# Altium schematic sheet 1.1.6_Interface_board_Pressure&IMU.SchDoc
size A4; DocumentNumber: 8; SheetNumber: 8; SheetTotal: 14
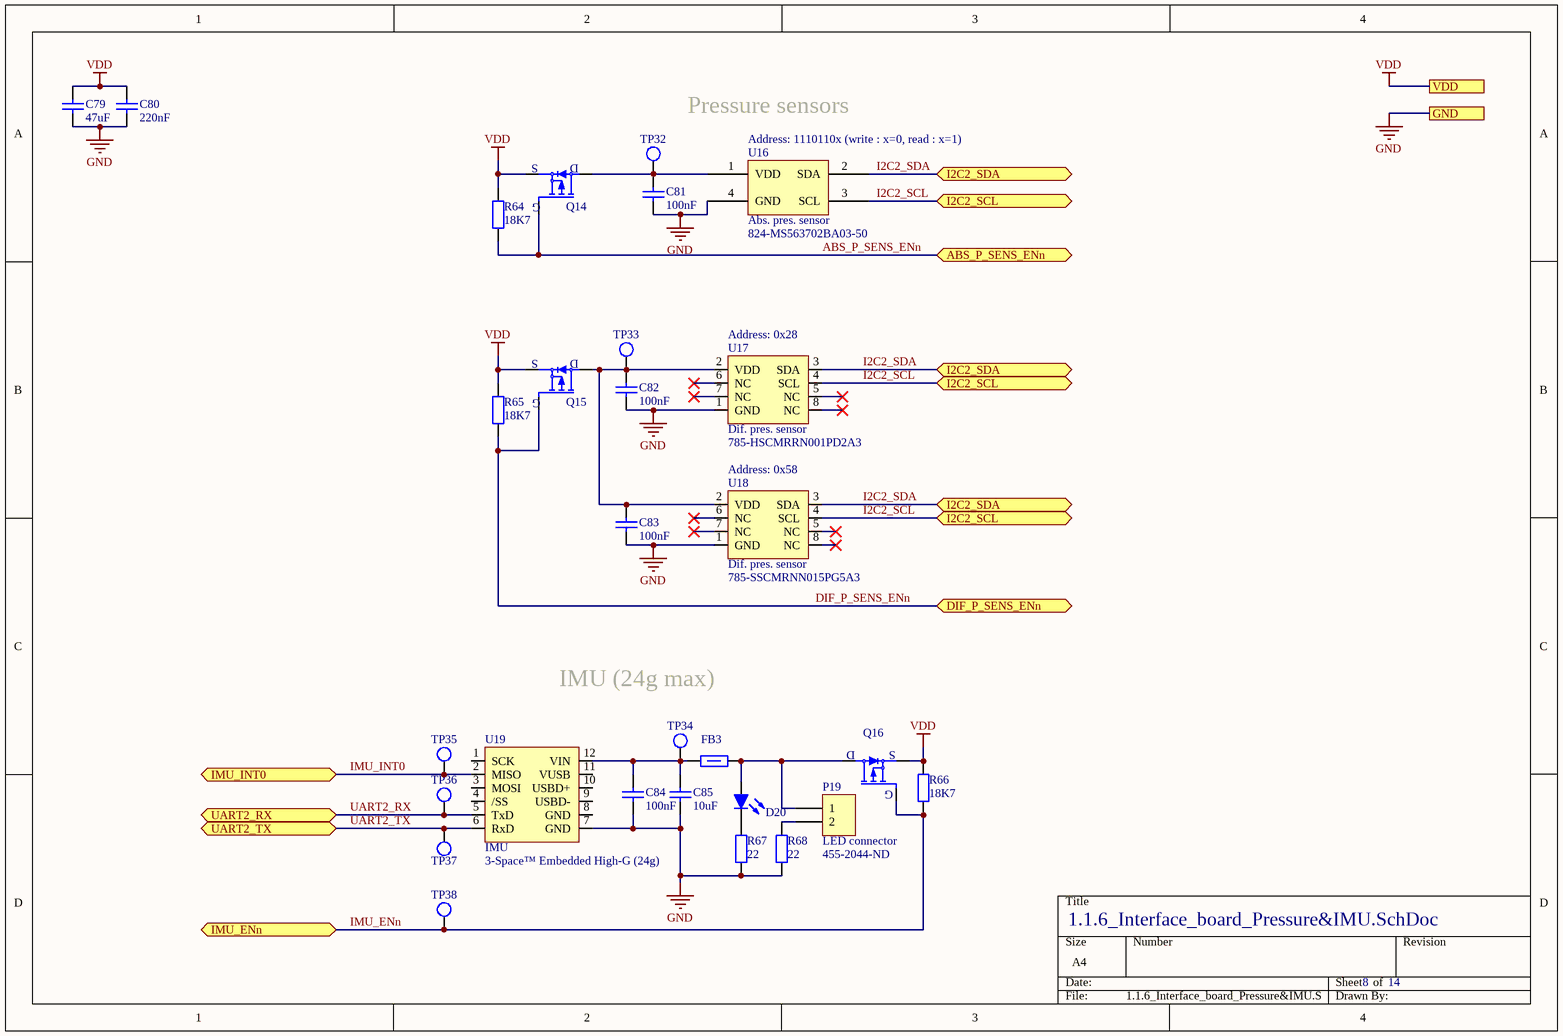
[diagram p0: 1.1.6_Interface_board_Pressure&IMU.SchDoc]

## Parts
C79  47uF  [CAP1206W]
C80  220nF  [CAP0603R]
C81  100nF  [CAP0603R]
C82  100nF  [CAP0603R]
C83  100nF  [CAP0603R]
C84  100nF  [CAP0603R]
C85  10uF  [CAP0805W]
D20  LED  [WL-SMCW]  (value not drawn)
FB3  81-BLM18KG601SZ1D  [0603]  (value not drawn)
P19  LED connector  Supplier Part Number 1: 455-2044-ND  [CON_JST_XA_ S02B-XASS-1]
Q14  MOSFET_P  [SOT23]  (value not drawn)
Q15  MOSFET_P  [SOT23]  (value not drawn)
Q16  MOSFET_P  [SOT23]  (value not drawn)
R64  18K7  [0603]
R65  18K7  [0603]
R66  18K7  [0603]
R67  22  [0603]
R68  22  [0603]
TP32  Test point  [TP]  (value not drawn)
TP33  Test point  [TP]  (value not drawn)
TP34  Test point  [TP]  (value not drawn)
TP35  Test point  [TP]  (value not drawn)
TP36  Test point  [TP]  (value not drawn)
TP37  Test point  [TP]  (value not drawn)
TP38  Test point  [TP]  (value not drawn)
U16  Abs. pres. sensor  Supplier Part Number 1: 824-MS563702BA03-50  [SMD_3.0X3.0MM_4P]
U17  Dif. pres. sensor  Supplier Part Number 1: 785-HSCMRRN001PD2A3  [HSCMRRN060PDSA3]
U18  Dif. pres. sensor  Supplier Part Number 1: 785-SSCMRNN015PG5A3  [HSCMRRN060PDSA3]
U19  IMU  Supplier Part Number 1: 3-Space™ Embedded High-G (24g)  [Yost Labs 3-Spac Embedded]

## Ports
ABS_P_SENS_ENn (bidir), DIF_P_SENS_ENn (bidir), GND, I2C2_SCL (bidir), I2C2_SDA (bidir), IMU_ENn (bidir), IMU_INT0 (bidir), UART2_RX (bidir), UART2_TX (bidir), VDD

## Nets
GND: C79.1 C80.1 C81.1 C82.1 C83.1 C84.1 C85.1 R67.1 R68.1 U16.4(GND) U17.1(GND) U18.1(GND) U19.7(GND) ; port GND
VDD: C79.2 C80.2 Q14.2(S) Q15.2(S) Q16.2(S) R64.2 R65.2 R66.2 ; port VDD
ABS_P_SENS_ENn: Q14.1(G) R64.1 ; port ABS_P_SENS_ENn
DIF_P_SENS_ENn: Q15.1(G) R65.1 ; port DIF_P_SENS_ENn
I2C2_SCL: U16.3(SCL) U17.4(SCL) U18.4(SCL) ; port I2C2_SCL
I2C2_SDA: U16.2(SDA) U17.3(SDA) U18.3(SDA) ; port I2C2_SDA
IMU_ENn: Q16.1(G) R66.1 TP38.1 ; port IMU_ENn
IMU_INT0: TP35.1 U19.2(MISO) ; port IMU_INT0
UART2_RX: TP36.1 U19.5(TxD) ; port UART2_RX
UART2_TX: TP37.1 U19.6(RxD) ; port UART2_TX
NetC81_2: C81.2 Q14.3(D) TP32.1 U16.1(VDD)
NetC82_2: C82.2 C83.2 Q15.3(D) TP33.1 U17.2(VDD) U18.2(VDD)
NetC84_2: C84.2 C85.2 FB3.1 TP34.1 U19.12(VIN)
NetD20_A: D20.A FB3.2 P19.1 Q16.3(D)
NetD20_C: D20.C R67.2
NetP19_2: P19.2 R68.2

Not connected (* = marked no-connect by the designer): U17 5(NC)* 6(NC)* 7(NC)* 8(NC)*; U18 5(NC)* 6(NC)* 7(NC)* 8(NC)*; U19 1(SCK) 3(MOSI) 4(/SS) 8(GND) 9(USBD-) 10(USBD+) 11(VUSB)

## Notes on the sheet
- Pressure sensors
- (near U16) Address: 1110110x (write : x=0, read : x=1)
- (near U17) Address: 0x28
- (near U18) Address: 0x58
- IMU (24g max)

## Library data of the parts
C79 = C_47uF_25v_1206: Capacitor; Supplier 1: Mouser; Supplier Part Number 1: 810-C3216X5R1E476M
C80 = C_220nF: Capacitor; Supplier 1: Mouser; Supplier Part Number 1: 81-GCG188R91H224KA1D
C81-C84 = C_100nF: Capacitor; Supplier 1: Mouser; Supplier Part Number 1: 81-GCG188R91H104KA1D
C85 = C_10uF_16v: Capacitor; Supplier 1: Mouser; Supplier Part Number 1: 81-GRT21BC81C106ME1L
D20 = LED_SMD_GREEN_0603: Standard LEDs - SMD WL-SMCW Waterclr 0603 Green; Supplier 1: Mouser; Supplier Part Number 1: 710-150060GS75000
FB3 = Ferrite_bead: Supplier 1: Mouser; Supplier Part Number 1: 81-BLM18KG601SZ1D
P19 = Header 2p JST XA 3A right angle: Supplier 1: Digi-Key
Q14-Q16 = MOSFET_P_ 20V_1.5A: MOSFET 40V P-channel Trench MOSFET SOT-23-3; Supplier 1: Mouser; Supplier Part Number 1: 771-PMV250EPEAR
R64-R66 = R_0603_01W_18K7: 0.1W 18K7; Supplier 1: Mouser; Supplier Part Number 1: 667-ERJ-3EKF1872V
R67 R68 = R_0603_025W_22Ohm: 0.25W 22Ohm; LatestRevisionDate: 17-Jul-2002; LatestRevisionNote: Re-released for DXP Platform.; PackageReference: AXIAL-0.4; PackageDescription: Axial Device, Thru-Hole; 2 Leads; 0.4 in Pin Spacing; Supplier 1: Mouser; Supplier Part Number 1: 667-ERJ-PA3J220V
U16 = MS563702BA03-50: Pressure sensor; Supplier 1: Mouser
U17 = HSCMRRN001PD2A3: Diff pressure sensor 1 psi; Supplier 1: Mouser
U18 = SSCMRNN015PG5A3: Diff pressure sensor 0 psi to 15 psi; Supplier 1: Mouser
U19 = YostLab_3-Space_Embedded: Supplier 1: Yost Labs